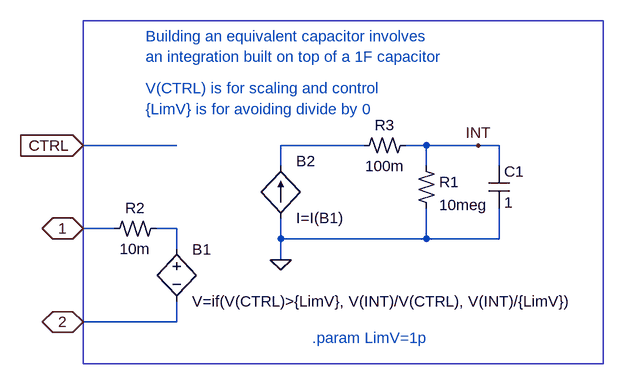
[diagram p0: schematic Cs.asc]
Cs.asc, the LTspice schematic file:
Version 4
SHEET 1 880 680
WIRE 112 -64 -32 -64
WIRE 400 -64 272 -64
WIRE 496 -64 464 -64
WIRE 576 -64 496 -64
WIRE 608 -64 576 -64
WIRE 272 -32 272 -64
WIRE 496 -32 496 -64
WIRE 608 -32 608 -64
WIRE 16 64 -32 64
WIRE 112 64 80 64
WIRE 272 80 272 48
WIRE 496 80 496 32
WIRE 496 80 272 80
WIRE 608 80 608 32
WIRE 608 80 496 80
WIRE 112 96 112 64
WIRE 272 112 272 80
WIRE 112 208 112 176
WIRE 112 208 -32 208
FLAG -32 64 1
IOPIN -32 64 BiDir
FLAG -32 208 2
IOPIN -32 208 BiDir
FLAG 272 112 0
FLAG -32 -64 CTRL
IOPIN -32 -64 In
FLAG 576 -64 INT
SYMBOL bv 112 80 R0
SYMATTR InstName B1
SYMATTR Value V=if(V(CTRL)>{LimV}, V(INT)/V(CTRL), V(INT)/{LimV})
SYMBOL bi 272 48 M180
WINDOW 0 24 88 Left 0
WINDOW 3 24 0 Left 0
SYMATTR InstName B2
SYMATTR Value I=I(B1)
SYMBOL cap 592 -32 R0
SYMATTR InstName C1
SYMATTR Value 1
SYMATTR SpiceLine Rpar=1meg
SYMBOL res2 480 -32 R0
SYMATTR InstName R1
SYMATTR Value 10meg
SYMBOL res2 80 48 R90
WINDOW 0 0 32 VBottom 0
WINDOW 3 32 32 VTop 0
SYMATTR InstName R2
SYMATTR Value 10m
SYMBOL res2 464 -80 R90
WINDOW 0 0 32 VBottom 0
WINDOW 3 32 32 VTop 0
SYMATTR InstName R3
SYMATTR Value 100m
TEXT 64 -232 Left 0 ;Building an equivalent capacitor involves\nan integration built on top of a 1F capacitor
TEXT 64 -152 Left 0 ;V(CTRL) is for scaling and control
TEXT 64 -120 Left 0 ;{LimV} is for avoiding divide by 0
TEXT 320 232 Left 0 ;.param LimV=1p
RECTANGLE Normal 768 272 -32 -256

The netlist it stands for:
* Cs.asc
B1 N002 2 V=if(V(CTRL)>{LimV}, V(INT)/V(CTRL), V(INT)/{LimV})
B2 0 N001 I=I(B1)
C1 INT 0 1 Rpar=1meg
R1 INT 0 10meg
R2 N002 1 10m
R3 INT N001 100m
* Building an equivalent capacitor involves
* an integration built on top of a 1F capacitor
* V(CTRL) is for scaling and control
* {LimV} is for avoiding divide by 0
* .param LimV=1p
.backanno
.end